# EAGLE design uni_node (EAGLE 9.6.2)

## Sheet 1 of 2
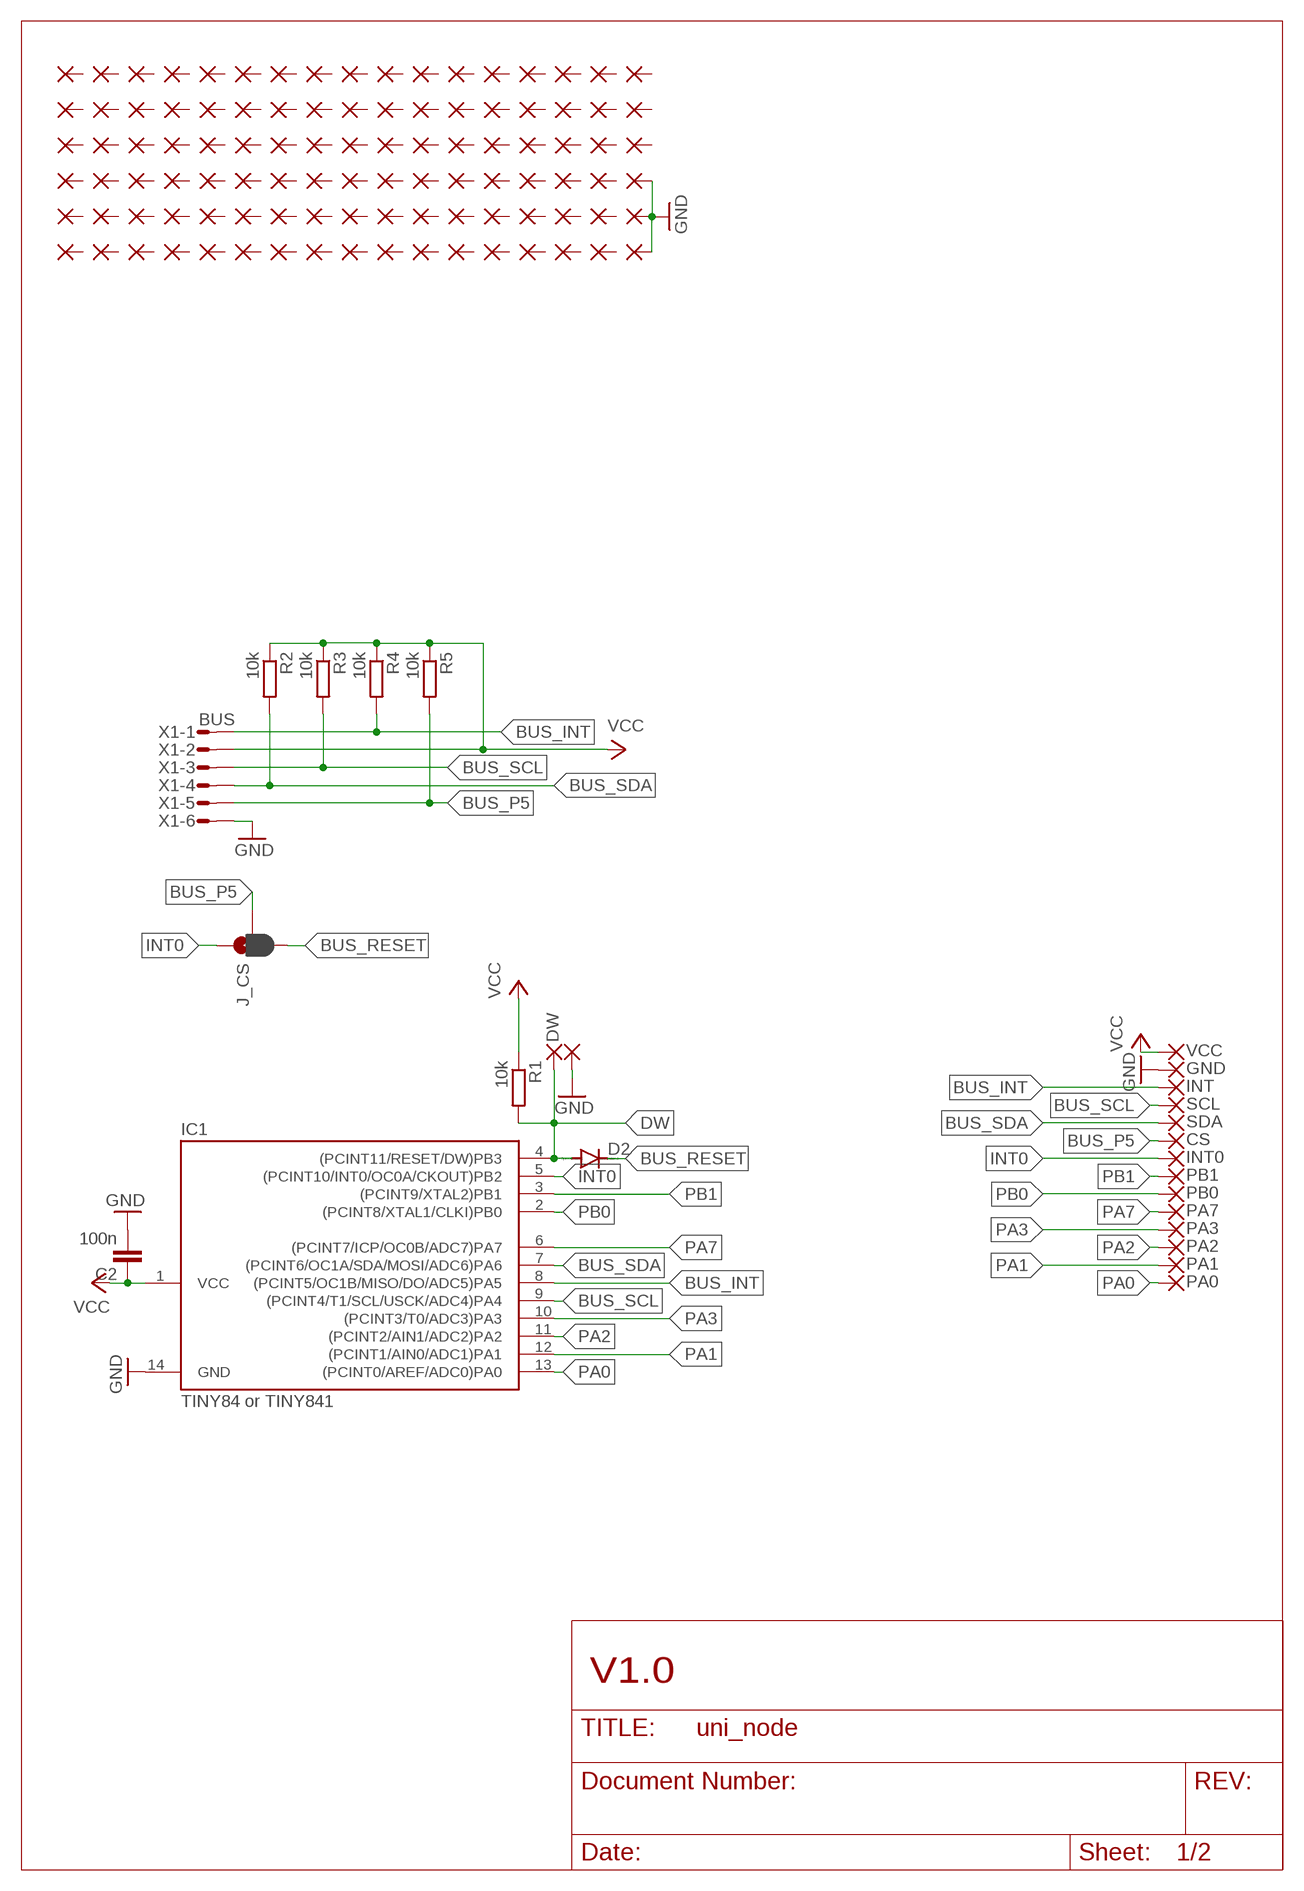
[diagram p0: schematic, sheet 1]

### Parts
C2  100n  C-EUC0805  [C0805]
CS  1,6/0,9  [1,6/0,9]
D2  DIODE-MINIMELF  [MINIMELF]
DW  1,6/0,9  [1,6/0,9]
GND  1,6/0,9  [1,6/0,9]
GND_  1,6/0,9  [1,6/0,9]
IC1  TINY84 or TINY841  TINY24/44/84-SSU  [SOIC14]
INT  1,6/0,9  [1,6/0,9]
INT0  1,6/0,9  [1,6/0,9]
J_CS  JUMPER-SMT_3_1-NC_PASTE_NO-SILK  [SMT-JUMPER_3_1-NC_PASTE_NO-SILK]
PA0  1,6/0,9  [1,6/0,9]
PA1  1,6/0,9  [1,6/0,9]
PA2  1,6/0,9  [1,6/0,9]
PA3  1,6/0,9  [1,6/0,9]
PA7  1,6/0,9  [1,6/0,9]
PAD1  1,6/0,9  [1,6/0,9]
PAD2  1,6/0,9  [1,6/0,9]
PAD3  1,6/0,9  [1,6/0,9]
PAD4  1,6/0,9  [1,6/0,9]
PAD5  1,6/0,9  [1,6/0,9]
PAD6  1,6/0,9  [1,6/0,9]
PAD7  1,6/0,9  [1,6/0,9]
PAD8  1,6/0,9  [1,6/0,9]
PAD9  1,6/0,9  [1,6/0,9]
PAD10  1,6/0,9  [1,6/0,9]
PAD11  1,6/0,9  [1,6/0,9]
PAD12  1,6/0,9  [1,6/0,9]
PAD13  1,6/0,9  [1,6/0,9]
PAD14  1,6/0,9  [1,6/0,9]
PAD15  1,6/0,9  [1,6/0,9]
PAD16  1,6/0,9  [1,6/0,9]
PAD17  1,6/0,9  [1,6/0,9]
PAD18  1,6/0,9  [1,6/0,9]
PAD19  1,6/0,9  [1,6/0,9]
PAD20  1,6/0,9  [1,6/0,9]
PAD21  1,6/0,9  [1,6/0,9]
PAD22  1,6/0,9  [1,6/0,9]
PAD23  1,6/0,9  [1,6/0,9]
PAD24  1,6/0,9  [1,6/0,9]
PAD25  1,6/0,9  [1,6/0,9]
PAD26  1,6/0,9  [1,6/0,9]
PAD27  1,6/0,9  [1,6/0,9]
PAD28  1,6/0,9  [1,6/0,9]
PAD29  1,6/0,9  [1,6/0,9]
PAD30  1,6/0,9  [1,6/0,9]
PAD31  1,6/0,9  [1,6/0,9]
PAD32  1,6/0,9  [1,6/0,9]
PAD33  1,6/0,9  [1,6/0,9]
PAD34  1,6/0,9  [1,6/0,9]
PAD35  1,6/0,9  [1,6/0,9]
PAD36  1,6/0,9  [1,6/0,9]
PAD37  1,6/0,9  [1,6/0,9]
PAD38  1,6/0,9  [1,6/0,9]
PAD39  1,6/0,9  [1,6/0,9]
PAD40  1,6/0,9  [1,6/0,9]
PAD41  1,6/0,9  [1,6/0,9]
PAD42  1,6/0,9  [1,6/0,9]
PAD43  1,6/0,9  [1,6/0,9]
PAD44  1,6/0,9  [1,6/0,9]
PAD45  1,6/0,9  [1,6/0,9]
PAD46  1,6/0,9  [1,6/0,9]
PAD47  1,6/0,9  [1,6/0,9]
PAD48  1,6/0,9  [1,6/0,9]
PAD49  1,6/0,9  [1,6/0,9]
PAD50  1,6/0,9  [1,6/0,9]
PAD51  1,6/0,9  [1,6/0,9]
PAD52  1,6/0,9  [1,6/0,9]
PAD53  1,6/0,9  [1,6/0,9]
PAD54  1,6/0,9  [1,6/0,9]
PAD55  1,6/0,9  [1,6/0,9]
PAD56  1,6/0,9  [1,6/0,9]
PAD57  1,6/0,9  [1,6/0,9]
PAD58  1,6/0,9  [1,6/0,9]
PAD59  1,6/0,9  [1,6/0,9]
PAD60  1,6/0,9  [1,6/0,9]
PAD61  1,6/0,9  [1,6/0,9]
PAD62  1,6/0,9  [1,6/0,9]
PAD63  1,6/0,9  [1,6/0,9]
PAD64  1,6/0,9  [1,6/0,9]
PAD65  1,6/0,9  [1,6/0,9]
PAD66  1,6/0,9  [1,6/0,9]
PAD67  1,6/0,9  [1,6/0,9]
PAD68  1,6/0,9  [1,6/0,9]
PAD69  1,6/0,9  [1,6/0,9]
PAD70  1,6/0,9  [1,6/0,9]
PAD71  1,6/0,9  [1,6/0,9]
PAD72  1,6/0,9  [1,6/0,9]
PAD73  1,6/0,9  [1,6/0,9]
PAD74  1,6/0,9  [1,6/0,9]
PAD75  1,6/0,9  [1,6/0,9]
PAD76  1,6/0,9  [1,6/0,9]
PAD77  1,6/0,9  [1,6/0,9]
PAD78  1,6/0,9  [1,6/0,9]
PAD79  1,6/0,9  [1,6/0,9]
PAD80  1,6/0,9  [1,6/0,9]
PAD81  1,6/0,9  [1,6/0,9]
PAD82  1,6/0,9  [1,6/0,9]
PAD83  1,6/0,9  [1,6/0,9]
PAD84  1,6/0,9  [1,6/0,9]
PAD85  1,6/0,9  [1,6/0,9]
PAD86  1,6/0,9  [1,6/0,9]
PAD87  1,6/0,9  [1,6/0,9]
PAD88  1,6/0,9  [1,6/0,9]
PAD89  1,6/0,9  [1,6/0,9]
PAD90  1,6/0,9  [1,6/0,9]
PAD91  1,6/0,9  [1,6/0,9]
PAD92  1,6/0,9  [1,6/0,9]
PAD93  1,6/0,9  [1,6/0,9]
PAD94  1,6/0,9  [1,6/0,9]
PAD95  1,6/0,9  [1,6/0,9]
PAD96  1,6/0,9  [1,6/0,9]
PAD97  1,6/0,9  [1,6/0,9]
PAD98  1,6/0,9  [1,6/0,9]
PAD99  1,6/0,9  [1,6/0,9]
PAD100  1,6/0,9  [1,6/0,9]
PAD101  1,6/0,9  [1,6/0,9]
PAD102  1,6/0,9  [1,6/0,9]
PB0  1,6/0,9  [1,6/0,9]
PB1  1,6/0,9  [1,6/0,9]
R1  10k  R-EU_M0805  [M0805]
R2  10k  R-EU_M0805  [M0805]
R3  10k  R-EU_M0805  [M0805]
R4  10k  R-EU_M0805  [M0805]
R5  10k  R-EU_M0805  [M0805]
SCL  1,6/0,9  [1,6/0,9]
SDA  1,6/0,9  [1,6/0,9]
VCC  1,6/0,9  [1,6/0,9]
X1  BUS  MICROMATCH-6  [MICROMATCH-6]

### Nets
BUS_INT: IC1.8((PCINT5/OC1B/MISO/DO/ADC5)PA5) INT.1(P) R4.2 X1.1
BUS_P5: CS.1(P) J_CS.2 R5.2 X1.5
BUS_RESET: D2.C J_CS.3
BUS_SCL: IC1.9((PCINT4/T1/SCL/USCK/ADC4)PA4) R3.2 SCL.1(P) X1.3
BUS_SDA: IC1.7((PCINT6/OC1A/SDA/MOSI/ADC6)PA6) R2.2 SDA.1(P) X1.4
DW: D2.A DW.1(P) IC1.4((PCINT11/RESET/DW)PB3) R1.2
GND: C2.2 GND.1(P) GND_.1(P) IC1.14(GND) PAD100.1(P) PAD101.1(P) PAD102.1(P) X1.6
INT0: IC1.5((PCINT10/INT0/OC0A/CKOUT)PB2) INT0.1(P) J_CS.1
PA0: IC1.13((PCINT0/AREF/ADC0)PA0) PA0.1(P)
PA1: IC1.12((PCINT1/AIN0/ADC1)PA1) PA1.1(P)
PA2: IC1.11((PCINT2/AIN1/ADC2)PA2) PA2.1(P)
PA3: IC1.10((PCINT3/T0/ADC3)PA3) PA3.1(P)
PA7: IC1.6((PCINT7/ICP/OC0B/ADC7)PA7) PA7.1(P)
PB0: IC1.2((PCINT8/XTAL1/CLKI)PB0) PB0.1(P)
PB1: IC1.3((PCINT9/XTAL2)PB1) PB1.1(P)
VCC: C2.1 IC1.1(VCC) R1.1 R2.1 R3.1 R4.1 R5.1 VCC.1(P) X1.2
Unconnected: PAD1.1(P) PAD2.1(P) PAD3.1(P) PAD4.1(P) PAD5.1(P) PAD6.1(P) PAD7.1(P) PAD8.1(P) PAD9.1(P) PAD10.1(P) PAD11.1(P) PAD12.1(P) PAD13.1(P) PAD14.1(P) PAD15.1(P) PAD16.1(P) PAD17.1(P) PAD18.1(P) PAD19.1(P) PAD20.1(P) PAD21.1(P) PAD22.1(P) PAD23.1(P) PAD24.1(P) PAD25.1(P) PAD26.1(P) PAD27.1(P) PAD28.1(P) PAD29.1(P) PAD30.1(P) PAD31.1(P) PAD32.1(P) PAD33.1(P) PAD34.1(P) PAD35.1(P) PAD36.1(P) PAD37.1(P) PAD38.1(P) PAD39.1(P) PAD40.1(P) PAD41.1(P) PAD42.1(P) PAD43.1(P) PAD44.1(P) PAD45.1(P) PAD46.1(P) PAD47.1(P) PAD48.1(P) PAD49.1(P) PAD50.1(P) PAD51.1(P) PAD52.1(P) PAD53.1(P) PAD54.1(P) PAD55.1(P) PAD56.1(P) PAD57.1(P) PAD58.1(P) PAD59.1(P) PAD60.1(P) PAD61.1(P) PAD62.1(P) PAD63.1(P) PAD64.1(P) PAD65.1(P) PAD66.1(P) PAD67.1(P) PAD68.1(P) PAD69.1(P) PAD70.1(P) PAD71.1(P) PAD72.1(P) PAD73.1(P) PAD74.1(P) PAD75.1(P) PAD76.1(P) PAD77.1(P) PAD78.1(P) PAD79.1(P) PAD80.1(P) PAD81.1(P) PAD82.1(P) PAD83.1(P) PAD84.1(P) PAD85.1(P) PAD86.1(P) PAD87.1(P) PAD88.1(P) PAD89.1(P) PAD90.1(P) PAD91.1(P) PAD92.1(P) PAD93.1(P) PAD94.1(P) PAD95.1(P) PAD96.1(P) PAD97.1(P) PAD98.1(P) PAD99.1(P)

### Notes on the sheet
- V1.0

## Sheet 2 of 2

## Library data of the parts
C2 = rcl:C-EU: CAPACITOR, European symbol
CS DW GND GND_ INT INT0 PA0 PA1-PA3 PA7 PAD1-PAD102 PB0 PB1 SCL SDA VCC = wirepad:1,6/0,9: THROUGH-HOLE PAD
D2 = diode:DIODE-: DIODE
IC1 = avr-7:TINY24/44/84
J_CS = SparkFun-Jumpers:JUMPER-SMT_3_1-NC_PASTE: Normally closed solder jumper (1 of 2 connections) This jumper has an aperture in the stencil to allow solder paste to bridge one of the two connections. One connection is normally closed (NC), while the other is normally open (NO). Wick off the solder to open the connection. Reapply solder to reclose the connection. Apply solder to the other side instead to change the current path.
R1-R5 = rcl:R-EU_: RESISTOR, European symbol; SPICEPREFIX: R
X1 = con-amp-micromatch:MICROMATCH-6: MicroMaTch 6 7-215464-6 / 0-215464-6 Drawing Number C-215464 DDEController.pdf; MPN: 7-215464-6; OC_FARNELL: 3784630; OC_NEWARK: 19R8125

## Net classes
1 gnd: width 0.381 mm, drill 0.381 mm
2 power: width 0.762 mm, drill 0.762 mm

## Board
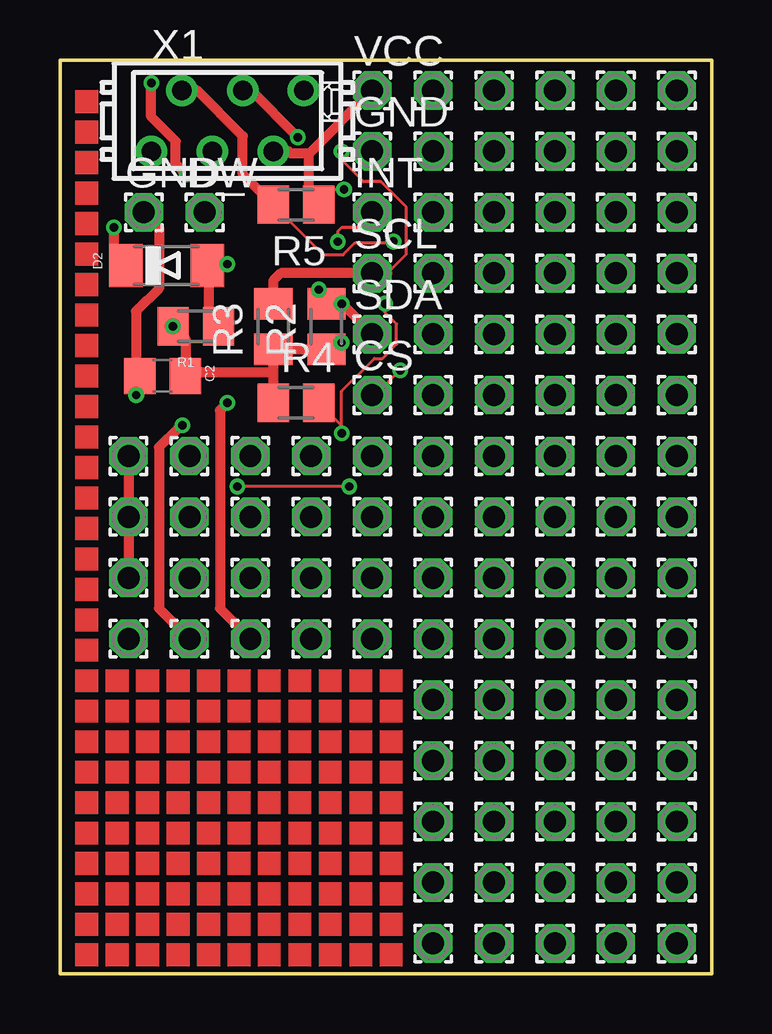
[diagram p1: board, top side]
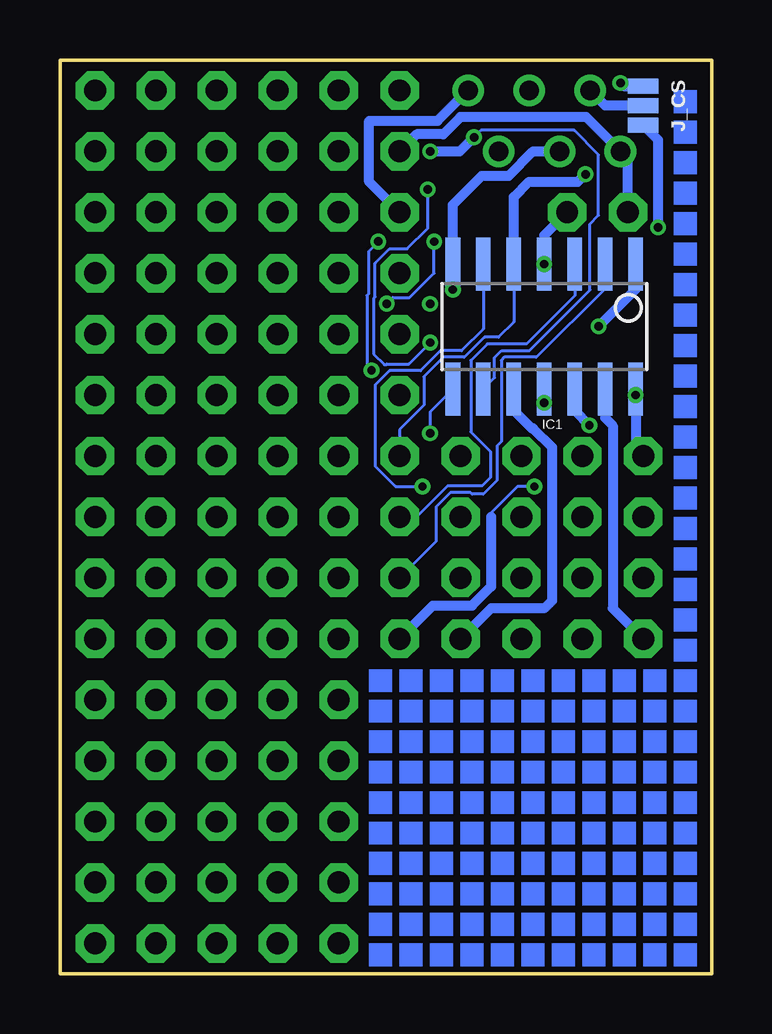
[diagram p2: board, bottom side, seen from below]

Size 27.18 x 38.1 mm. Coordinates in mm from the lower left corner, seen from the top.
Outline: 0,0 27.18,0 27.18,38.1 0,38.1 0,0
Copper layers (1*16): Top 0.035mm / dielectric 1.5mm / Bottom 0.035mm
Design rules "eagle": minimum track width 5mil, minimum drill 12mil, track to track 6mil, track to pad 6mil, pad to pad 6mil, via to via 6mil, smd to smd 0mil, copper to edge 10mil, drill to drill 10mil, minimum pad ring 10mil, minimum via ring 6mil, stop-mask expansion 2mil, vias tented up to drill 25mil, thermal gap 10mil

### Footprints (pad centres in the part's own frame; a part is rotated, then mirrored left to right if it is on the bottom)
C0805 = smd 1.3 x 1.5: 1 -0.95,0; 2 0.95,0
1,6/0,9 = drill 0.914 pad 1.6 octagon: 1 0,0
MINIMELF = smd 1.4 x 1.8: A 1.7,0; C -1.7,0
SOIC14 = smd 0.61 x 2.21: 1 -3.81,-2.603; 2 -2.54,-2.603; 3 -1.27,-2.603; 4 0,-2.603; 5 1.27,-2.603; 6 2.54,-2.603; 7 3.81,-2.603; 8 3.81,2.603; 9 2.54,2.603; 10 1.27,2.603; 11 0,2.603; 12 -1.27,2.603; 13 -2.54,2.603; 14 -3.81,2.603
SMT-JUMPER_3_1-NC_PASTE_NO-SILK = smd 0.635 x 1.27: 1 -0.813,0; 2 0,0; 3 0.813,0
M0805 = smd 1.3 x 1.6: 1 -0.95,0; 2 0.95,0
MICROMATCH-6 = drill 0.813: 1 3.175,1.27; 2 1.905,-1.27; 3 0.635,1.27; 4 -0.635,-1.27; 5 -1.905,1.27; 6 -3.175,-1.27

### Placement (x,y rotation side)
C2  4.28,24.93 180 top
CS  13.02,24.13 0 top
D2  4.45,29.53 0 top
DW  6.03,31.75 0 top
GND  13.02,34.29 0 top
GND_  3.49,31.75 0 top
IC1  6.99,26.99 180 bottom
INT  13.02,31.75 0 top
INT0  13.02,21.59 0 top
J_CS  2.86,36.2 270 bottom
PA0  2.86,13.97 0 top
PA1  5.4,13.97 0 top
PA2  7.94,13.97 0 top
PA3  10.48,13.97 0 top
PA7  13.02,13.97 0 top
PAD1  15.56,1.27 0 top
PAD2  18.1,1.27 0 top
PAD3  20.64,1.27 0 top
PAD4  23.18,1.27 0 top
PAD5  25.72,1.27 0 top
PAD7  25.72,3.81 0 top
PAD8  23.18,3.81 0 top
PAD10  15.56,3.81 0 top
PAD11  20.64,3.81 0 top
PAD12  18.1,3.81 0 top
PAD13  15.56,6.35 0 top
PAD14  18.1,6.35 0 top
PAD15  23.18,6.35 0 top
PAD16  20.64,6.35 0 top
PAD18  25.72,6.35 0 top
PAD19  15.56,8.89 0 top
PAD20  18.1,8.89 0 top
PAD21  20.64,8.89 0 top
PAD22  23.18,8.89 0 top
PAD24  25.72,8.89 0 top
PAD25  15.56,11.43 0 top
PAD26  25.72,19.05 0 top
PAD28  15.56,19.05 0 top
PAD29  20.64,19.05 0 top
PAD30  23.18,19.05 0 top
PAD31  23.18,16.51 0 top
PAD33  18.1,19.05 0 top
PAD34  15.56,16.51 0 top
PAD35  18.1,16.51 0 top
PAD36  25.72,16.51 0 top
PAD37  15.56,13.97 0 top
PAD38  18.1,13.97 0 top
PAD39  20.64,16.51 0 top
PAD40  23.18,11.43 0 top
PAD43  20.64,11.43 0 top
PAD44  25.72,11.43 0 top
PAD45  25.72,13.97 0 top
PAD46  18.1,11.43 0 top
PAD47  20.64,13.97 0 top
PAD48  23.18,13.97 0 top
PAD49  15.56,21.59 0 top
PAD50  20.64,21.59 0 top
PAD51  18.1,24.13 0 top
PAD52  15.56,24.13 0 top
PAD53  25.72,21.59 0 top
PAD54  18.1,21.59 0 top
PAD55  23.18,21.59 0 top
PAD56  23.18,24.13 0 top
PAD57  20.64,24.13 0 top
PAD59  23.18,26.67 0 top
PAD60  20.64,26.67 0 top
PAD61  18.1,26.67 0 top
PAD62  25.72,24.13 0 top
PAD65  18.1,29.21 0 top
PAD66  15.56,29.21 0 top
PAD67  25.72,26.67 0 top
PAD68  15.56,26.67 0 top
PAD69  20.64,29.21 0 top
PAD70  23.18,29.21 0 top
PAD71  25.72,29.21 0 top
PAD72  15.56,31.75 0 top
PAD74  18.1,31.75 0 top
PAD75  20.64,31.75 0 top
PAD76  23.18,31.75 0 top
PAD78  25.72,31.75 0 top
PAD79  20.64,34.29 0 top
PAD80  18.1,34.29 0 top
PAD81  23.18,34.29 0 top
PAD82  25.72,34.29 0 top
PAD83  15.56,34.29 0 top
PAD84  23.18,36.83 0 top
PAD85  20.64,36.83 0 top
PAD86  15.56,36.83 0 top
PAD87  18.1,36.83 0 top
PAD89  5.4,21.59 0 top
PAD90  5.4,19.05 0 top
PAD91  7.94,16.51 0 top
PAD93  25.72,36.83 0 top
PAD94  10.48,16.51 0 top
PAD95  10.48,19.05 0 top
PAD96  5.4,16.51 0 top
PAD97  10.48,21.59 0 top
PAD98  7.94,21.59 0 top
PAD99  7.94,19.05 0 top
PAD100  2.86,16.51 0 top
PAD101  2.86,21.59 0 top
PAD102  2.86,19.05 0 top
PB0  13.02,16.51 0 top
PB1  13.02,19.05 0 top
R1  5.66,27 0 top
R2  11.11,26.99 90 top
R3  8.89,26.99 90 top
R4  9.84,23.81 0 top
R5  9.84,32.07 180 top
SCL  13.02,29.21 0 top
SDA  13.02,26.67 0 top
VCC  13.02,36.83 0 top
X1  6.99,35.56 0 top

### Tracks (layer width: path | path; a pad name or v marks a point on that pad's centre or on a via)
BUS_INT  (via drill 0.35)
  Top 0.127: v13.56,27.94 13.56,27.57 14.03,27.09 14.03,26.25 13.44,25.65 13.11,25.65 11.75,24.3 v11.75,22.54 11.75,22.86 R4.2 | INT.1 12.38,31.11 11.75,31.11 11.58,30.95 v11.58,30.53
  Bottom 0.127: IC1.8 11.75,23.43 v11.75,22.54 | v13.56,27.94 13.3,28.19 12.6,28.19 11.58,29.21 v11.58,30.53
  Bottom 0.406: INT.1 14.29,33.02 14.29,35.56 11.43,35.56 X1.1
BUS_P5  (via drill 0.35)
  Top 0.127: R5.2 10.97,29.98 11.8,29.98 12.3,30.48 13.85,30.48 v13.9,30.53 | v14.19,25.17 13.15,24.13 CS.1
  Top 0.406: R5.2 7.62,33.34 7.62,34.92 5.71,36.83 X1.5
  Bottom 0.127: v13.9,30.53 14.31,30.12 14.31,28.35 14.38,28.28 14.38,25.36 v14.19,25.17
  Bottom 0.406: J_CS.2 4.45,36.2 X1.5
BUS_RESET  (via drill 0.35)
  Top 0.406: v2.25,31.11 2.25,30.03 D2.C
  Bottom 0.406: J_CS.3 2.25,34.77 v2.25,31.11
BUS_SCL  (via drill 0.35)
  Top 0.127: 13.65,29.21 14.45,30 14.45,31.96 13.38,33.02 12.65,33.02 11.86,33.81 11.86,34.17
  Top 0.406: 13.65,29.21 SCL.1 9.21,29.21 8.89,28.89 R3.2 | 11.86,34.17 v11.74,34.29 | v9.91,34.88 7.96,36.83 X1.3
  Bottom 0.127: IC1.9 9.05,24.85 9.05,25.69 8.77,25.98 7.61,25.98 5.08,28.51 5.08,31.27 4.72,31.62 4.72,34.15 5.74,35.17 9.63,35.17 v9.91,34.88
  Bottom 0.406: v11.74,34.29 10.5,34.29 v9.91,34.88
BUS_SDA  (via drill 0.35)
  Top 0.127: v11.75,27.94 R2.2 10.79,28.25 v10.79,28.53
  Top 0.406: v11.75,27.94 SDA.1
  Bottom 0.127: IC1.7 v10.79,28.53
  Bottom 0.406: IC1.7 10.79,32.07 9.59,33.27 8.47,33.27 7.45,34.29 X1.4
DW  (via drill 0.35)
  Top 0.406: D2.A 6.21,29.59 | 6.21,29.59 IC1.4 | R1.2 6.21,27.41 6.21,29.59
  Bottom 0.406: DW.1 6.99,30.8 IC1.4
  other vias: 6.99,29.59
GND  (via drill 0.35)
  Top 0.127: v3.17,24.13 3.17,24.45 3.33,24.6 C2.2
  Top 0.406: PAD101.1 PAD102.1 PAD100.1 | GND_.1 4.13,31.11 4.13,28.57 3.17,27.62 3.17,25.09 C2.2
  Bottom 0.406: IC1.14 v3.17,24.13 3.17,21.91 PAD101.1 | GND.1 12.31,35 11.2,35 10.48,35.72 5.24,35.72 X1.6 3.49,33.97 GND_.1
INT0  (via drill 0.35)
  Top 0.406: v5.27,33.34 4.83,33.78 4.83,34.71 3.81,35.73 v3.81,37.15
  Bottom 0.127: IC1.5 8.26,27.18 8.89,26.54 9.48,26.54 10.31,25.7 11.19,25.7 12,24.89 12,23.71 13.02,22.69 INT0.1
  Bottom 0.406: IC1.5 8.26,32.38 7.62,33.02 5.58,33.02 v5.27,33.34 | v3.81,37.15 3.67,37.01 J_CS.1
PA0
  Bottom 0.406: IC1.13 4.45,23.18 4.13,22.86 4.13,15.24 PA0.1
PA1  (via drill 0.35)
  Top 0.406: v5.1,22.87 4.98,22.75 4.92,22.75 4.13,21.95 4.13,15.24 PA1.1
  Bottom 0.406: IC1.12 5.71,23.48 v5.1,22.87
PA2  (via drill 0.35)
  Top 0.406: v6.99,23.81 6.67,23.5 6.67,15.24 PA2.1
  Bottom 0.406: IC1.11 v6.99,23.81
PA3
  Bottom 0.406: IC1.10 8.26,23.5 7.51,22.75 7.46,22.75 6.67,21.95 6.67,15.56 6.99,15.24 9.21,15.24 PA3.1
PA7  (via drill 0.35)
  Top 0.127: v12.06,20.32 v7.4,20.32
  Bottom 0.127: IC1.6 9.53,26.89 10.43,25.98 11.3,25.98 12.14,25.15 13.44,25.15 14.03,24.55 14.03,21.17 13.18,20.32 v12.06,20.32 | 9.21,19.05 9.21,19.22 8.1,20.32 v7.4,20.32
  Bottom 0.406: PA7.1 11.63,15.35 10,15.35 9.21,16.15 9.21,19.05
PB0
  Bottom 0.127: IC1.2 4.45,28.57 7.32,25.7 8.65,25.7 8.78,25.58 8.78,22.19 8.95,22.01 8.95,20.57 9.53,20 9.99,20 10.06,20.07 10.9,20.07 11.49,19.47 11.49,18.03 PB0.1
PB1
  Bottom 0.127: IC1.3 5.71,28.27 7.72,26.26 9.36,26.26 10.05,25.58 10.05,22.59 9.23,21.78 9.23,20.69 9.58,20.34 11.01,20.34 12.31,19.05 PB1.1
VCC  (via drill 0.35)
  Top 0.127: R5.1 11.43,32.7 v11.84,32.7 | v11.74,26.32 11.46,26.04 R2.1
  Top 0.406: X1.2 9.54,34.29 9.63,34.19 10.38,34.19 | VCC.1 10.38,34.19 | R5.1 10.38,32.48 10.38,34.19 | R1.1 5.23,26.48 C2.1 5.38,25.08 8.89,25.08 | R2.1 R3.1 8.89,25.08 | 8.89,25.08 R4.1
  Bottom 0.127: v11.74,26.32 12.63,25.43 13.55,25.43 13.58,25.4 13.65,25.4 14.1,25.85 14.1,28.16 14.03,28.23 14.03,29.63 13.44,30.23 12.7,30.23 11.84,31.08 v11.84,32.7
  Bottom 0.406: IC1.1 3.17,28.54 R1.1
  other vias: 4.71,27
(copper drawn outside any net)
  shapes: Bottom area x129, Top area x129

### Text on the board
_tNames: X1 | VCC | GND | GND_ | DW | INT | R5 | D2 | SCL | SDA | R1 | R3 | R2 | C2 | R4 | CS
_bNames: J_CS | IC1